# EAGLE schematic MPU-9250_Breakout (EAGLE 7.4.0)
DESIGNER: Brent Wilkins; VERSION: v10
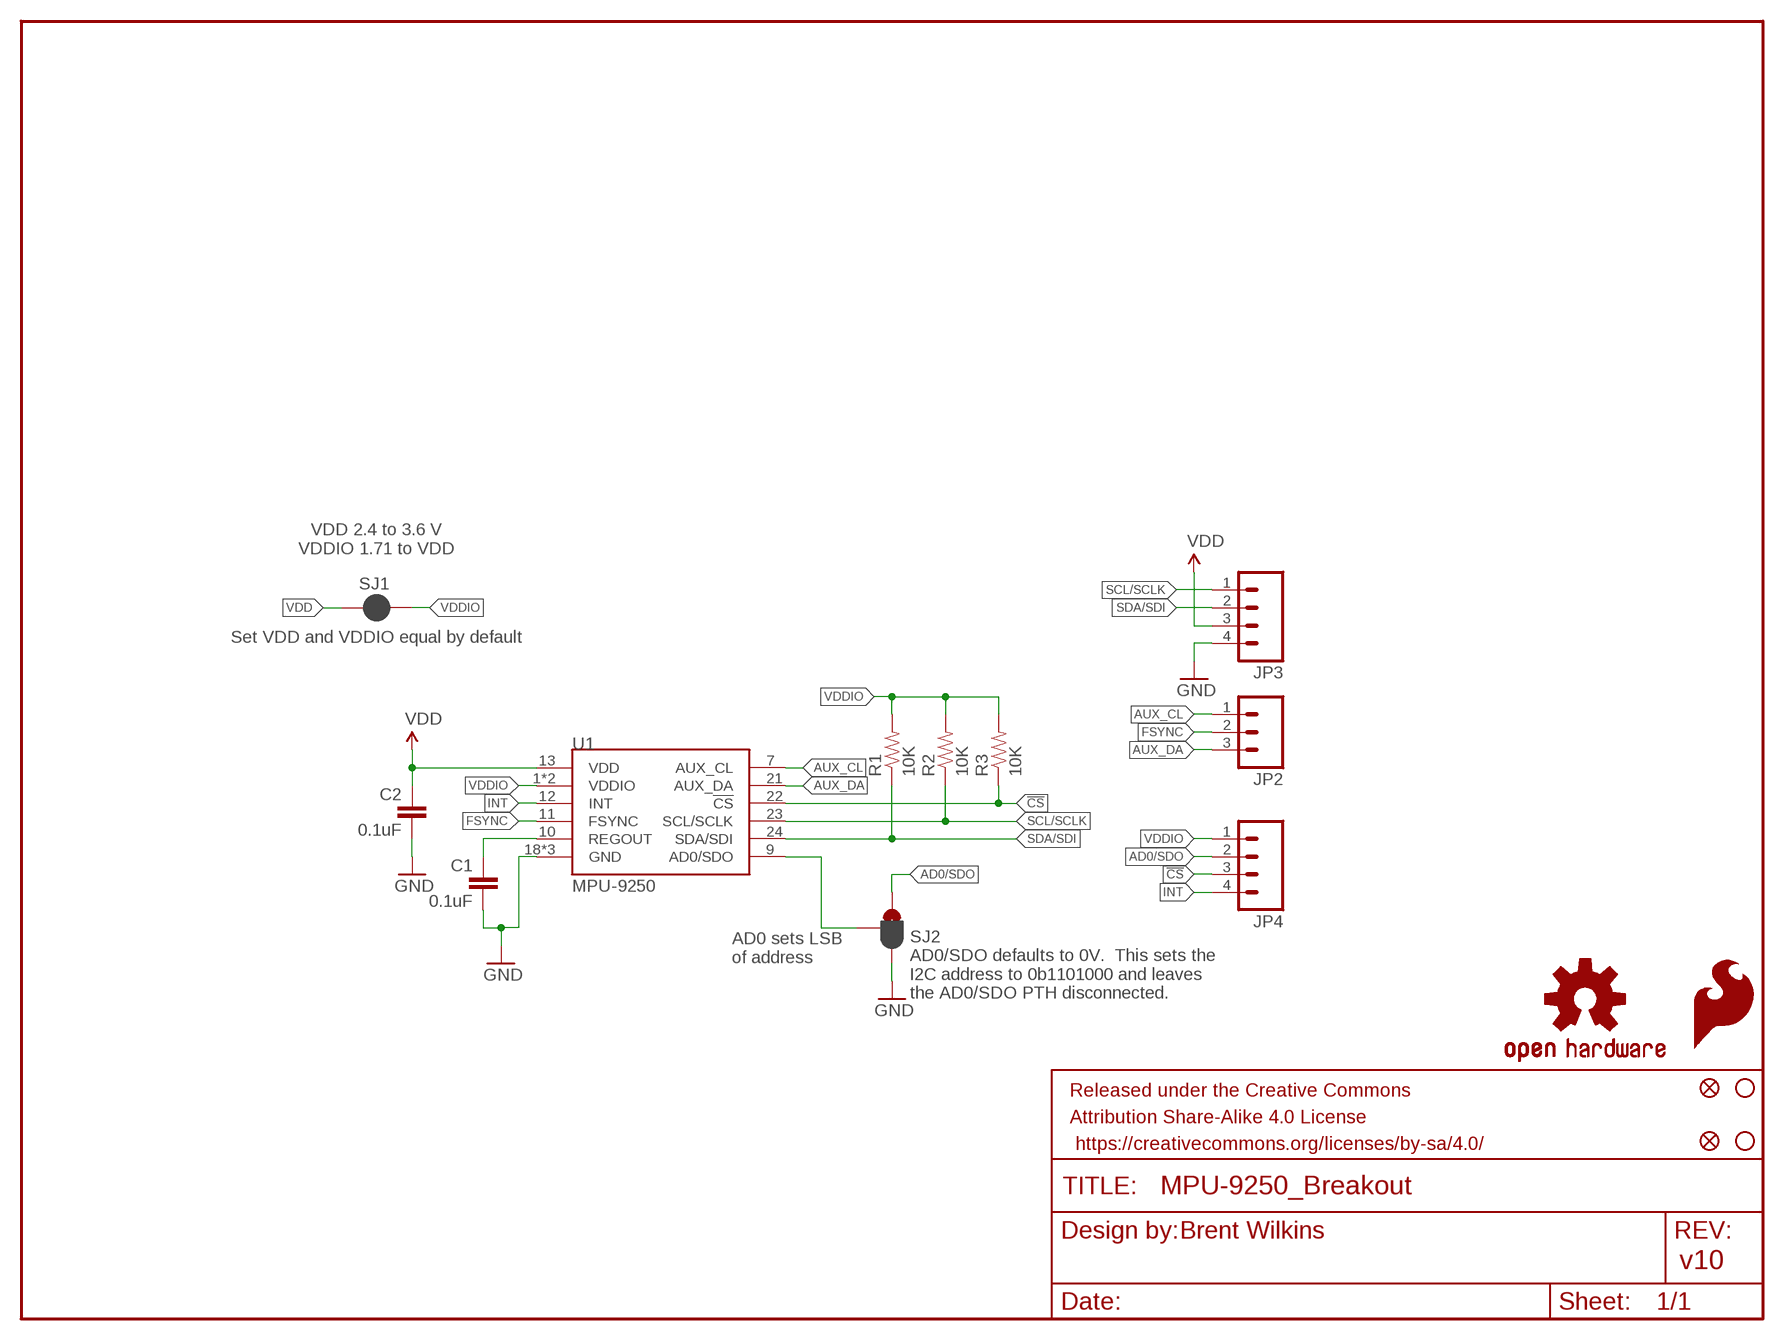
[diagram p0: schematic, sheet 1]

## Parts
C1  0.1uF  0.1UF-25V(+80/-20%)(0603)  [0603-CAP]
C2  0.1uF  0.1UF-25V(+80/-20%)(0603)  [0603-CAP]
FID1  FIDUCIAL1X2  [FIDUCIAL-1X2]
FID2  FIDUCIAL1X2  [FIDUCIAL-1X2]
FRAME1  FRAME-LETTER  [CREATIVE_COMMONS]
JP2  M03PTH  [1X03]
JP3  M04PTH  [1X04]
JP4  M04PTH  [1X04]
LOGO1  SFE_LOGO_FLAME.1_INCH  [SFE_LOGO_FLAME_.1]
LOGO2  OSHW-LOGOS  [OSHW-LOGO-S]
R1  10K  10KOHM-1/10W-1%(0603)0603  [0603-RES]
R2  10K  10KOHM-1/10W-1%(0603)0603  [0603-RES]
R3  10K  10KOHM-1/10W-1%(0603)0603  [0603-RES]
SJ1  JUMPER-PAD-2-NC_BY_PASTEFULL-BOX-SILK  [PAD-JUMPER-2-NC_BY_PASTE_YES_SILK_FULL_BOX]
SJ2  JUMPER_PAD-3-1&2_NC_BY_PASTE  [PAD-HUMPER-3-1&2_NC_BY_PASTE_YES_SILK_FULL_BOX]
STANDOFF1  STAND-OFF  [STAND-OFF]
STANDOFF2  STAND-OFF  [STAND-OFF]
U1  MPU-9250  [QFN24_PAD]

## Nets
!CS: JP4.3 R3.1 U1.22(!CS)
AD0/SDO: JP4.2 SJ2.3
ADSD_STUB: SJ2.2 U1.9(AD0/SDO)
AUX_CL: JP2.1 U1.7(AUX_CL)
AUX_DA: JP2.3 U1.21(AUX_DA)
FSYNC: JP2.2 U1.11(FSYNC)
GND: C1.2 C2.2 JP3.4 SJ2.1 U1.18(GND) U1.20(GND) U1.CENTER(GND)
INT: JP4.4 U1.12(INT)
REGOUT: C1.1 U1.10(REGOUT)
SCL/SCLK: JP3.1 R2.1 U1.23(SCL/SCLK)
SDA/SDI: JP3.2 R1.1 U1.24(SDA/SDI)
VDD: C2.1 JP3.3 SJ1.1 U1.13(VDD)
VDDIO: JP4.1 R1.2 R2.2 R3.2 SJ1.2 U1.1(VDDIO) U1.8(VDDIO)

## Notes on the sheet
- VDD 2.4 to 3.6 V
  VDDIO 1.71 to VDD
- Set VDD and VDDIO equal by default
- AD0 sets LSB
  of address
- AD0/SDO defaults to 0V.  This sets the
  I2C address to 0b1101000 and leaves
  the AD0/SDO PTH disconnected.

## Library data of the parts
C1 C2 = SparkFun-Capacitors:0.1UF-25V(+80/-20%)(0603): CAP-00810 Ceramic Standard decoupling cap; PROD_ID: CAP-00810
FID1 FID2 = SparkFun-Aesthetics:FIDUCIAL: Fiducial Alignment Points Various fiducial points for machine vision alignment.
FRAME1 = SparkFun-Aesthetics:FRAME-LETTER: Schematic Frame Standard 8.5x11 US Letter frame
JP2 = SparkFun-Connectors:M03: Header 3 Standard 3-pin 0.1" header. Use with straight break away headers (SKU : PRT-00116), right angle break away headers (PRT-00553), swiss pins (PRT-00743), machine pins (PRT-00117), and female headers (PRT-00115). Molex polarized connector foot print use with SKU : PRT-08232 with associated crimp pins and housings.
JP3 JP4 = SparkFun-Connectors:M04: Header 4 Standard 4-pin 0.1" header. Use with straight break away headers (SKU : PRT-00116), right angle break away headers (PRT-00553), swiss pins (PRT-00743), machine pins (PRT-00117), and female headers (PRT-00115). Molex polarized connector foot print use with SKU : PRT-08231 with associated crimp pins and housings. 1MM SMD Version SKU: PRT-10208
LOGO1 = SparkFun-Aesthetics:SFE_LOGO_FLAME: SFE Logo, flame only This is the SparkFun flame logo. The logo on the schematic will always be the same size; the package variant is the height of the flame. Default layer for the logo on the board is tSilk.
LOGO2 = SparkFun-Aesthetics:OSHW-LOGO: Open Source Hardware Logo This logo indicates the piece of hardware it is found on incorporates a OSHW license and/or adheres to the definition of open source hardware found here: http://freedomdefined.org/OSHW
R1-R3 = SparkFun-Resistors:10KOHM-1/10W-1%(0603): RES-00824; PROD_ID: RES-00824
SJ1 = SparkFun-Passives:JUMPER-PAD-2-NC_BY_PASTE
SJ2 = SparkFun-Passives:JUMPER_PAD-3-1&2_NC_BY_PASTE
STANDOFF1 STANDOFF2 = SparkFun-Electromechanical:STAND-OFF: #4 Stand Off This is the mechanical footprint for a #4 phillips button head screw. Use the keepout ring to avoid running the screw head into surrounding components. SKU : PRT-00447
U1 = Testing:MPU-9250: NC pin 19. 2-6 & 14-17 not internally connected. May be used for PCB trace routing.; PROD_ID: IC-13192